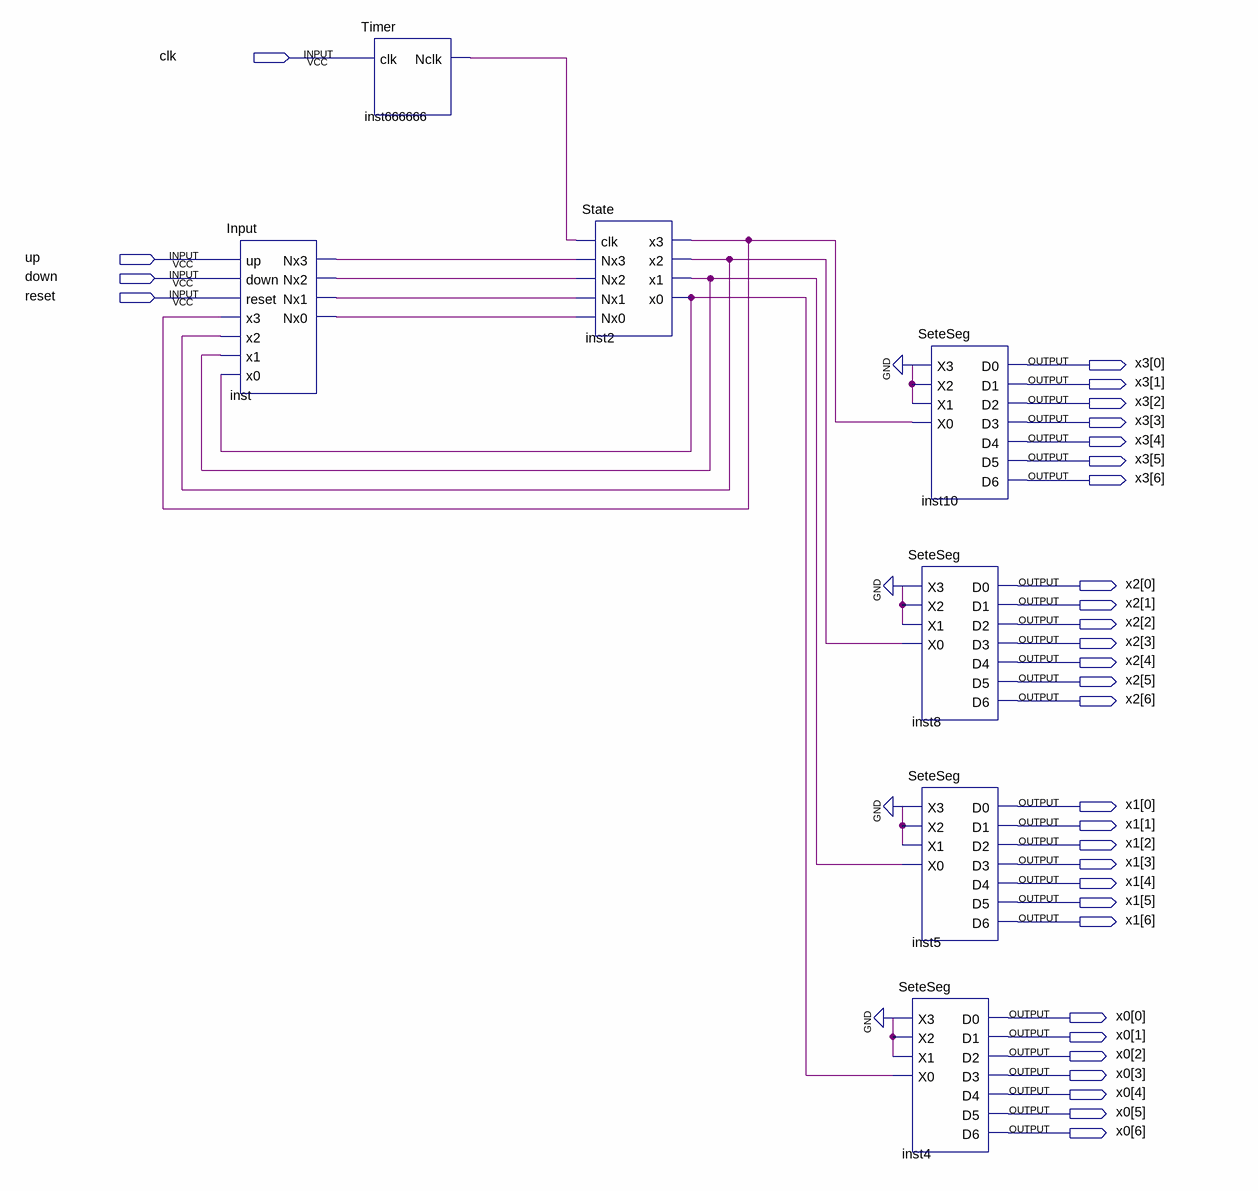
[diagram p0: schematic sheet]
// Quartus schematic MooreDebug.bdf as structural Verilog: 7 symbols, 32 pins
module MooreDebug (
  input  clk,
  input  up,
  input  down,
  input  reset,
  output [6:0] x3,
  output [6:0] x2,
  output [6:0] x1,
  output [6:0] x0
);

  wire inst2_x0, inst2_x1, inst2_x2, inst2_x3, inst666666_nclk, inst_nx0, inst_nx1, inst_nx2, inst_nx3;

  Input inst (
    .up(up), .down(down), .reset(reset), .x3(inst2_x3), .x2(inst2_x2), .x1(inst2_x1), .x0(inst2_x0),
    .Nx3(inst_nx3), .Nx2(inst_nx2), .Nx1(inst_nx1), .Nx0(inst_nx0));
  Timer inst666666 (.clk(clk), .Nclk(inst666666_nclk));
  State inst2 (
    .clk(inst666666_nclk), .Nx3(inst_nx3), .Nx2(inst_nx2), .Nx1(inst_nx1), .Nx0(inst_nx0), .x3(inst2_x3),
    .x2(inst2_x2), .x1(inst2_x1), .x0(inst2_x0));
  SeteSeg inst10 (
    .X3(1'b0), .X2(1'b0), .X1(1'b0), .X0(inst2_x3), .D0(x3[0]), .D1(x3[1]), .D2(x3[2]), .D3(x3[3]),
    .D4(x3[4]), .D5(x3[5]), .D6(x3[6]));
  SeteSeg inst8 (
    .X3(1'b0), .X2(1'b0), .X1(1'b0), .X0(inst2_x2), .D0(x2[0]), .D1(x2[1]), .D2(x2[2]), .D3(x2[3]),
    .D4(x2[4]), .D5(x2[5]), .D6(x2[6]));
  SeteSeg inst5 (
    .X3(1'b0), .X2(1'b0), .X1(1'b0), .X0(inst2_x1), .D0(x1[0]), .D1(x1[1]), .D2(x1[2]), .D3(x1[3]),
    .D4(x1[4]), .D5(x1[5]), .D6(x1[6]));
  SeteSeg inst4 (
    .X3(1'b0), .X2(1'b0), .X1(1'b0), .X0(inst2_x0), .D0(x0[0]), .D1(x0[1]), .D2(x0[2]), .D3(x0[3]),
    .D4(x0[4]), .D5(x0[5]), .D6(x0[6]));
endmodule
